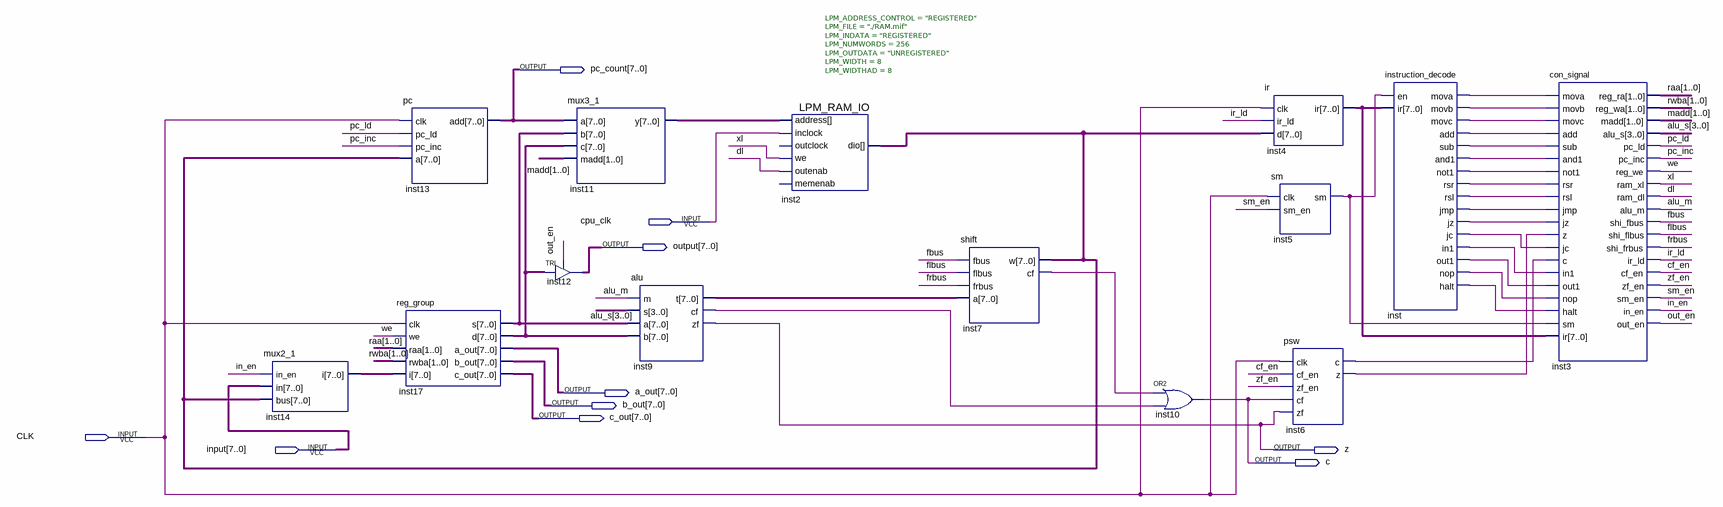
[diagram p0: schematic sheet]
// Quartus schematic simple_cpu.bdf as structural Verilog: 14 symbols, 10 pins
module simple_cpu (
  input  cpu_clk,
  input  CLK,
  input  [7:0] \input ,
  output [7:0] pc_count,
  output [7:0] \output ,
  output [7:0] a_out,
  output [7:0] b_out,
  output [7:0] c_out,
  output z,
  output c
);

  wire alu_m, cf_en, dl, fbus, flbus, frbus, in_en, inst5_sm, inst6_c, inst6_z, inst7_cf, inst9_cf, inst_add,
       inst_and1, inst_halt, inst_in1, inst_jc, inst_jmp, inst_jz, inst_mova, inst_movb, inst_movc, inst_nop,
       inst_not1, inst_out1, inst_rsl, inst_rsr, inst_sub, ir_ld, out_en, pc_inc, pc_ld, sm_en, we, xl, zf_en;
  wire [1:0] madd, raa, rwba;
  wire [3:0] alu_s;
  wire [7:0] inst2_dio, inst4_ir, inst9_t, inst11_y, inst14_i, inst17_d, inst17_s;

  mux2_1 inst14 (.in_en(in_en), .in(\input ), .bus(inst2_dio), .i(inst14_i));
  pc inst13 (.clk(CLK), .pc_ld(pc_ld), .pc_inc(pc_inc), .a(inst2_dio), .add(pc_count));
  reg_group inst17 (
    .clk(CLK), .we(we), .raa(raa), .rwba(rwba), .i(inst14_i), .s(inst17_s), .d(inst17_d), .a_out(a_out),
    .b_out(b_out), .c_out(c_out));
  TRI inst12[7:0] (.IN(inst17_d), .OE(out_en), .OUT(\output ));
  mux3_1 inst11 (.a(pc_count), .b(inst17_s), .c(inst17_d), .madd(madd), .y(inst11_y));
  alu inst9 (.m(alu_m), .s(alu_s), .a(inst17_s), .b(inst17_d), .t(inst9_t), .cf(inst9_cf), .zf(z));
  LPM_RAM_IO #(.LPM_ADDRESS_CONTROL("REGISTERED"), .LPM_FILE("./RAM.mif"), .LPM_INDATA("REGISTERED"), .LPM_NUMWORDS(256), .LPM_OUTDATA("UNREGISTERED"), .LPM_WIDTH(8), .LPM_WIDTHAD(8)) inst2 (
    .address(inst11_y), .inclock(cpu_clk), .we(xl), .outenab(dl), .dio(inst2_dio));  // open: outclock, memenab
  shift inst7 (.fbus(fbus), .flbus(flbus), .frbus(frbus), .a(inst9_t), .w(inst2_dio), .cf(inst7_cf));
  or inst10 (c, inst7_cf, inst9_cf);
  ir inst4 (.clk(CLK), .ir_ld(ir_ld), .d(inst2_dio), .ir(inst4_ir));
  sm inst5 (.clk(CLK), .sm_en(sm_en), .sm(inst5_sm));
  psw inst6 (.clk(CLK), .cf_en(cf_en), .zf_en(zf_en), .cf(c), .zf(z), .c(inst6_c), .z(inst6_z));
  instruction_decode inst (
    .en(inst5_sm), .ir(inst4_ir), .mova(inst_mova), .movb(inst_movb), .movc(inst_movc), .add(inst_add),
    .sub(inst_sub), .and1(inst_and1), .not1(inst_not1), .rsr(inst_rsr), .rsl(inst_rsl), .jmp(inst_jmp),
    .jz(inst_jz), .jc(inst_jc), .in1(inst_in1), .out1(inst_out1), .nop(inst_nop), .halt(inst_halt));
  con_signal inst3 (
    .mova(inst_mova), .movb(inst_movb), .movc(inst_movc), .add(inst_add), .sub(inst_sub), .and1(inst_and1),
    .not1(inst_not1), .rsr(inst_rsr), .rsl(inst_rsl), .jmp(inst_jmp), .jz(inst_jz), .z(inst6_z),
    .jc(inst_jc), .c(inst6_c), .in1(inst_in1), .out1(inst_out1), .nop(inst_nop), .halt(inst_halt),
    .sm(inst5_sm), .ir(inst4_ir), .reg_ra(raa), .reg_wa(rwba), .madd(madd), .alu_s(alu_s), .pc_ld(pc_ld),
    .pc_inc(pc_inc), .reg_we(we), .ram_xl(xl), .ram_dl(dl), .alu_m(alu_m), .shi_fbus(fbus),
    .shi_flbus(flbus), .shi_frbus(frbus), .ir_ld(ir_ld), .cf_en(cf_en), .zf_en(zf_en), .sm_en(sm_en),
    .in_en(in_en), .out_en(out_en));
endmodule
